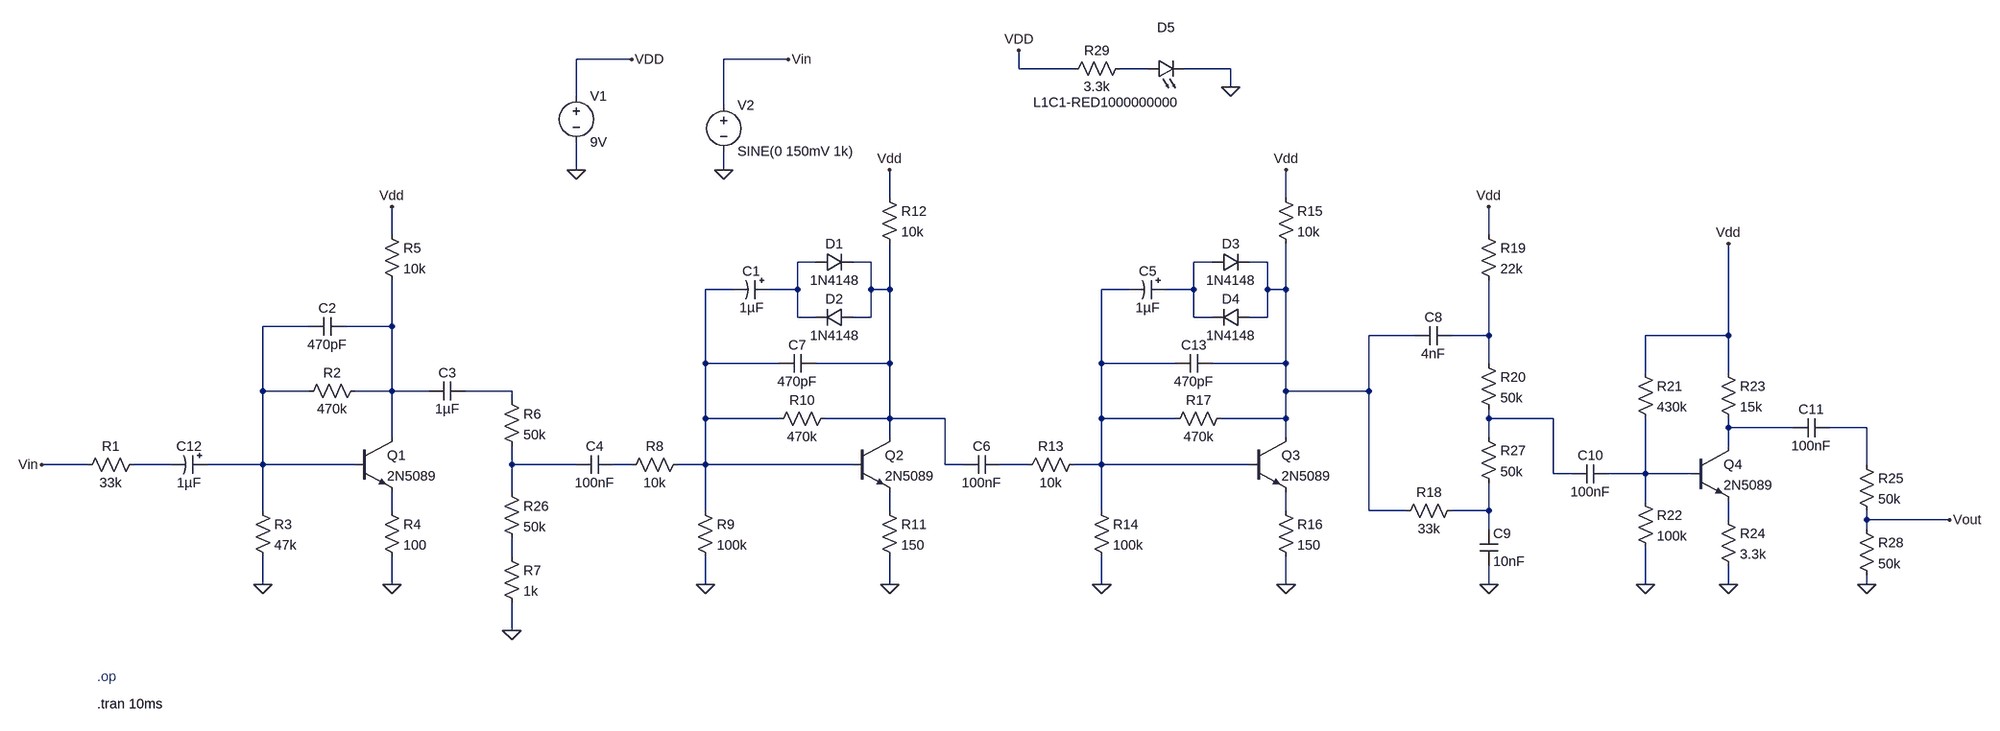
[diagram p0: schematic Big Muff Pi.asc]
Big Muff Pi.asc, the LTspice schematic file:
Version 4.1
SHEET 1 3512 680
WIRE 1008 -592 912 -592
WIRE 1280 -592 1168 -592
WIRE 1680 -576 1680 -608
WIRE 1776 -576 1680 -576
WIRE 1904 -576 1856 -576
WIRE 2048 -576 1968 -576
WIRE 2048 -544 2048 -576
WIRE 912 -528 912 -592
WIRE 1168 -512 1168 -592
WIRE 912 -400 912 -448
WIRE 1168 -400 1168 -432
WIRE 1456 -352 1456 -400
WIRE 2144 -352 2144 -400
WIRE 592 -288 592 -336
WIRE 2496 -288 2496 -336
WIRE 1328 -240 1296 -240
WIRE 1424 -240 1392 -240
WIRE 2016 -240 1984 -240
WIRE 2112 -240 2080 -240
WIRE 1184 -192 1136 -192
WIRE 1296 -192 1296 -240
WIRE 1296 -192 1248 -192
WIRE 1424 -192 1424 -240
WIRE 1456 -192 1456 -272
WIRE 1456 -192 1424 -192
WIRE 1872 -192 1824 -192
WIRE 1984 -192 1984 -240
WIRE 1984 -192 1936 -192
WIRE 2112 -192 2112 -240
WIRE 2144 -192 2144 -272
WIRE 2144 -192 2112 -192
WIRE 1296 -144 1296 -192
WIRE 1328 -144 1296 -144
WIRE 1424 -144 1424 -192
WIRE 1424 -144 1392 -144
WIRE 1984 -144 1984 -192
WIRE 2016 -144 1984 -144
WIRE 2112 -144 2112 -192
WIRE 2112 -144 2080 -144
WIRE 448 -128 368 -128
WIRE 592 -128 592 -208
WIRE 592 -128 512 -128
WIRE 2368 -112 2288 -112
WIRE 2496 -112 2496 -208
WIRE 2496 -112 2432 -112
WIRE 2912 -112 2912 -272
WIRE 2912 -112 2768 -112
WIRE 1136 -64 1136 -192
WIRE 1264 -64 1136 -64
WIRE 1456 -64 1456 -192
WIRE 1456 -64 1328 -64
WIRE 1824 -64 1824 -192
WIRE 1952 -64 1824 -64
WIRE 2144 -64 2144 -192
WIRE 2144 -64 2016 -64
WIRE 2496 -64 2496 -112
WIRE 2768 -48 2768 -112
WIRE 2912 -48 2912 -112
WIRE 368 -16 368 -128
WIRE 448 -16 368 -16
WIRE 592 -16 592 -128
WIRE 592 -16 528 -16
WIRE 656 -16 592 -16
WIRE 800 -16 720 -16
WIRE 2144 -16 2144 -64
WIRE 2288 -16 2288 -112
WIRE 2288 -16 2144 -16
WIRE 800 0 800 -16
WIRE 1136 32 1136 -64
WIRE 1264 32 1136 32
WIRE 1456 32 1456 -64
WIRE 1456 32 1344 32
WIRE 1552 32 1456 32
WIRE 1824 32 1824 -64
WIRE 1952 32 1824 32
WIRE 2144 32 2144 -16
WIRE 2144 32 2032 32
WIRE 2496 32 2496 16
WIRE 2608 32 2496 32
WIRE 2912 48 2912 32
WIRE 3024 48 2912 48
WIRE 3152 48 3088 48
WIRE 592 64 592 -16
WIRE 1456 64 1456 32
WIRE 2144 64 2144 32
WIRE 2496 64 2496 32
WIRE 2912 80 2912 48
WIRE 64 112 -16 112
WIRE 208 112 144 112
WIRE 368 112 368 -16
WIRE 368 112 272 112
WIRE 528 112 368 112
WIRE 800 112 800 80
WIRE 912 112 800 112
WIRE 1008 112 976 112
WIRE 1136 112 1136 32
WIRE 1136 112 1088 112
WIRE 1392 112 1136 112
WIRE 1552 112 1552 32
WIRE 1584 112 1552 112
WIRE 1696 112 1648 112
WIRE 1824 112 1824 32
WIRE 1824 112 1776 112
WIRE 2080 112 1824 112
WIRE 3152 112 3152 48
WIRE 2608 128 2608 32
WIRE 2640 128 2608 128
WIRE 2768 128 2768 32
WIRE 2768 128 2704 128
WIRE 2848 128 2768 128
WIRE 800 160 800 112
WIRE 2768 176 2768 128
WIRE 368 192 368 112
WIRE 592 192 592 160
WIRE 1136 192 1136 112
WIRE 1456 192 1456 160
WIRE 1824 192 1824 112
WIRE 2144 192 2144 160
WIRE 2288 192 2288 -16
WIRE 2352 192 2288 192
WIRE 2496 192 2496 144
WIRE 2496 192 2432 192
WIRE 2912 208 2912 176
WIRE 3152 208 3152 192
WIRE 3296 208 3152 208
WIRE 2496 224 2496 192
WIRE 3152 224 3152 208
WIRE 800 272 800 240
WIRE 368 320 368 272
WIRE 592 320 592 272
WIRE 1136 320 1136 272
WIRE 1456 320 1456 272
WIRE 1824 320 1824 272
WIRE 2144 320 2144 272
WIRE 2496 320 2496 288
WIRE 2768 320 2768 256
WIRE 2912 320 2912 288
WIRE 3152 320 3152 304
WIRE 800 400 800 352
FLAG 592 320 0
FLAG 368 320 0
FLAG 592 -336 Vdd
FLAG 800 400 0
FLAG 1456 320 0
FLAG 1136 320 0
FLAG 1456 -400 Vdd
FLAG 2144 320 0
FLAG 1824 320 0
FLAG 2496 -336 Vdd
FLAG 2496 320 0
FLAG 2768 320 0
FLAG 2912 -272 Vdd
FLAG 2912 320 0
FLAG 3152 320 0
FLAG 3296 208 Vout
FLAG -16 112 Vin
FLAG 2144 -400 Vdd
FLAG 912 -400 0
FLAG 1008 -592 VDD
FLAG 1168 -400 0
FLAG 1280 -592 Vin
FLAG 1680 -608 VDD
FLAG 2048 -544 0
SYMBOL res 160 96 R90
WINDOW 0 0 56 VBottom 2
WINDOW 3 32 56 VTop 2
SYMATTR InstName R1
SYMATTR Value 33k
SYMBOL res 352 176 R0
SYMATTR InstName R3
SYMATTR Value 47k
SYMBOL npn 528 64 R0
SYMATTR InstName Q1
SYMATTR Value 2N5089
SYMBOL res 544 -32 R90
WINDOW 0 0 56 VBottom 2
WINDOW 3 32 56 VTop 2
SYMATTR InstName R2
SYMATTR Value 470k
SYMBOL cap 512 -144 R90
WINDOW 0 0 32 VBottom 2
WINDOW 3 32 32 VTop 2
SYMATTR InstName C2
SYMATTR Value 470pF
SYMBOL res 576 176 R0
SYMATTR InstName R4
SYMATTR Value 100
SYMBOL res 576 -304 R0
SYMATTR InstName R5
SYMATTR Value 10k
SYMBOL cap 720 -32 R90
WINDOW 0 0 32 VBottom 2
WINDOW 3 32 32 VTop 2
SYMATTR InstName C3
SYMATTR Value 1µF
SYMBOL res 784 -16 R0
SYMATTR InstName R6
SYMATTR Value 50k
SYMBOL res 784 256 R0
SYMATTR InstName R7
SYMATTR Value 1k
SYMBOL cap 976 96 R90
WINDOW 0 0 32 VBottom 2
WINDOW 3 32 32 VTop 2
SYMATTR InstName C4
SYMATTR Value 100nF
SYMBOL res 1104 96 R90
WINDOW 0 0 56 VBottom 2
WINDOW 3 32 56 VTop 2
SYMATTR InstName R8
SYMATTR Value 10k
SYMBOL res 1120 176 R0
SYMATTR InstName R9
SYMATTR Value 100k
SYMBOL npn 1392 64 R0
SYMATTR InstName Q2
SYMATTR Value 2N5089
SYMBOL res 1360 16 R90
WINDOW 0 0 56 VBottom 2
WINDOW 3 32 56 VTop 2
SYMATTR InstName R10
SYMATTR Value 470k
SYMBOL res 1440 176 R0
SYMATTR InstName R11
SYMATTR Value 150
SYMBOL res 1440 -368 R0
SYMATTR InstName R12
SYMATTR Value 10k
SYMBOL diode 1328 -224 R270
WINDOW 0 32 32 VTop 2
WINDOW 3 0 32 VBottom 2
SYMATTR InstName D1
SYMATTR Value 1N4148
SYMBOL diode 1392 -160 R90
WINDOW 0 0 32 VBottom 2
WINDOW 3 32 32 VTop 2
SYMATTR InstName D2
SYMATTR Value 1N4148
SYMBOL cap 1648 96 R90
WINDOW 0 0 32 VBottom 2
WINDOW 3 32 32 VTop 2
SYMATTR InstName C6
SYMATTR Value 100nF
SYMBOL res 1792 96 R90
WINDOW 0 0 56 VBottom 2
WINDOW 3 32 56 VTop 2
SYMATTR InstName R13
SYMATTR Value 10k
SYMBOL res 1808 176 R0
SYMATTR InstName R14
SYMATTR Value 100k
SYMBOL npn 2080 64 R0
SYMATTR InstName Q3
SYMATTR Value 2N5089
SYMBOL res 2128 176 R0
SYMATTR InstName R16
SYMATTR Value 150
SYMBOL cap 2432 -128 R90
WINDOW 0 0 32 VBottom 2
WINDOW 3 32 32 VTop 2
SYMATTR InstName C8
SYMATTR Value 4nF
SYMBOL res 2448 176 R90
WINDOW 0 0 56 VBottom 2
WINDOW 3 32 56 VTop 2
SYMATTR InstName R18
SYMATTR Value 33k
SYMBOL res 2480 -304 R0
SYMATTR InstName R19
SYMATTR Value 22k
SYMBOL cap 2480 224 R0
SYMATTR InstName C9
SYMATTR Value 10nF
SYMBOL res 2480 -80 R0
SYMATTR InstName R20
SYMATTR Value 50k
SYMBOL cap 2704 112 R90
WINDOW 0 0 32 VBottom 2
WINDOW 3 32 32 VTop 2
SYMATTR InstName C10
SYMATTR Value 100nF
SYMBOL npn 2848 80 R0
SYMATTR InstName Q4
SYMATTR Value 2N5089
SYMBOL res 2752 -64 R0
SYMATTR InstName R21
SYMATTR Value 430k
SYMBOL res 2752 160 R0
SYMATTR InstName R22
SYMATTR Value 100k
SYMBOL res 2896 -64 R0
SYMATTR InstName R23
SYMATTR Value 15k
SYMBOL res 2896 192 R0
SYMATTR InstName R24
SYMATTR Value 3.3k
SYMBOL cap 3088 32 R90
WINDOW 0 0 32 VBottom 2
WINDOW 3 32 32 VTop 2
SYMATTR InstName C11
SYMATTR Value 100nF
SYMBOL res 3136 96 R0
SYMATTR InstName R25
SYMATTR Value 50k
SYMBOL polcap 272 96 R90
WINDOW 0 0 32 VBottom 2
WINDOW 3 32 32 VTop 2
SYMATTR InstName C12
SYMATTR Value 1µF
SYMBOL polcap 1248 -208 R90
WINDOW 0 0 32 VBottom 2
WINDOW 3 32 32 VTop 2
SYMATTR InstName C1
SYMATTR Value 1µF
SYMBOL res 784 144 R0
SYMATTR InstName R26
SYMATTR Value 50k
SYMBOL cap 1328 -80 R90
WINDOW 0 0 32 VBottom 2
WINDOW 3 32 32 VTop 2
SYMATTR InstName C7
SYMATTR Value 470pF
SYMBOL res 2128 -368 R0
SYMATTR InstName R15
SYMATTR Value 10k
SYMBOL diode 2016 -224 R270
WINDOW 0 32 32 VTop 2
WINDOW 3 0 32 VBottom 2
SYMATTR InstName D3
SYMATTR Value 1N4148
SYMBOL diode 2080 -160 R90
WINDOW 0 0 32 VBottom 2
WINDOW 3 32 32 VTop 2
SYMATTR InstName D4
SYMATTR Value 1N4148
SYMBOL polcap 1936 -208 R90
WINDOW 0 0 32 VBottom 2
WINDOW 3 32 32 VTop 2
SYMATTR InstName C5
SYMATTR Value 1µF
SYMBOL cap 2016 -80 R90
WINDOW 0 0 32 VBottom 2
WINDOW 3 32 32 VTop 2
SYMATTR InstName C13
SYMATTR Value 470pF
SYMBOL res 2048 16 R90
WINDOW 0 0 56 VBottom 2
WINDOW 3 32 56 VTop 2
SYMATTR InstName R17
SYMATTR Value 470k
SYMBOL res 2480 48 R0
SYMATTR InstName R27
SYMATTR Value 50k
SYMBOL res 3136 208 R0
SYMATTR InstName R28
SYMATTR Value 50k
SYMBOL voltage 912 -544 R0
SYMATTR InstName V1
SYMATTR Value 9V
SYMBOL voltage 1168 -528 R0
WINDOW 123 0 0 Left 0
WINDOW 39 0 0 Left 0
SYMATTR InstName V2
SYMATTR Value SINE(0 150mV 1k)
SYMBOL LED 1904 -560 R270
WINDOW 0 72 32 VTop 2
WINDOW 3 -27 -73 VBottom 2
SYMATTR InstName D5
SYMATTR Value L1C1-RED1000000000
SYMBOL res 1872 -592 R90
WINDOW 0 0 56 VBottom 2
WINDOW 3 32 56 VTop 2
SYMATTR InstName R29
SYMATTR Value 3.3k
TEXT 80 480 Left 2 ;.op
TEXT 80 528 Left 2 !.tran 10ms

The netlist it stands for:
* Big Muff Pi.asc
R1 N015 Vin 33k
R3 N008 0 47k
Q1 N009 N008 N020 0 2N5089
R2 N009 N008 470k
C2 N009 N008 470pF
R4 N020 0 100
R5 Vdd N009 10k
C3 N011 N009 1µF
R6 N011 N016 50k
R7 N025 0 1k
C4 N017 N016 100nF
R8 N006 N017 10k
R9 N006 0 100k
Q2 N003 N006 N021 0 2N5089
R10 N003 N006 470k
R11 N021 0 150
R12 Vdd N003 10k
D1 N002 N003 1N4148
D2 N003 N002 1N4148
C6 N018 N003 100nF
R13 N007 N018 10k
R14 N007 0 100k
Q3 N005 N007 N022 0 2N5089
R16 N022 0 150
C8 N010 N005 4nF
R18 N023 N005 33k
R19 Vdd N010 22k
C9 N023 0 10nF
R20 N010 N012 50k
C10 N019 N012 100nF
Q4 N013 N019 N024 0 2N5089
R21 Vdd N019 430k
R22 N019 0 100k
R23 Vdd N013 15k
R24 N024 0 3.3k
C11 N014 N013 100nF
R25 N014 Vout 50k
C12 N008 N015 1µF
C1 N002 N006 1µF
R26 N016 N025 50k
C7 N003 N006 470pF
R15 Vdd N005 10k
D3 N004 N005 1N4148
D4 N005 N004 1N4148
C5 N004 N007 1µF
C13 N005 N007 470pF
R17 N005 N007 470k
R27 N012 N023 50k
R28 Vout 0 50k
V1 Vdd 0 9V
V2 Vin 0 SINE(0 150mV 1k)
D5 N001 0 L1C1-RED1000000000
R29 N001 Vdd 3.3k
.model D D
.lib standard.dio
.model NPN NPN
.model PNP PNP
.lib standard.bjt
* .op
.tran 10ms
.backanno
.end